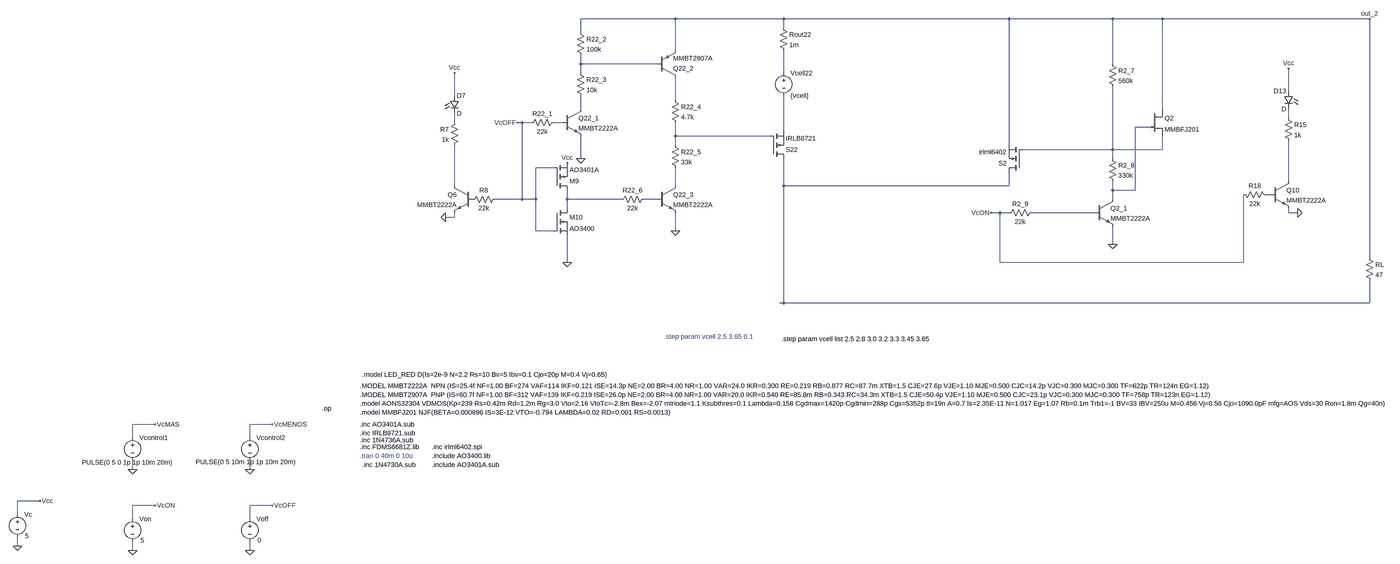
[diagram p0: schematic version_1x1.asc, whole sheet]
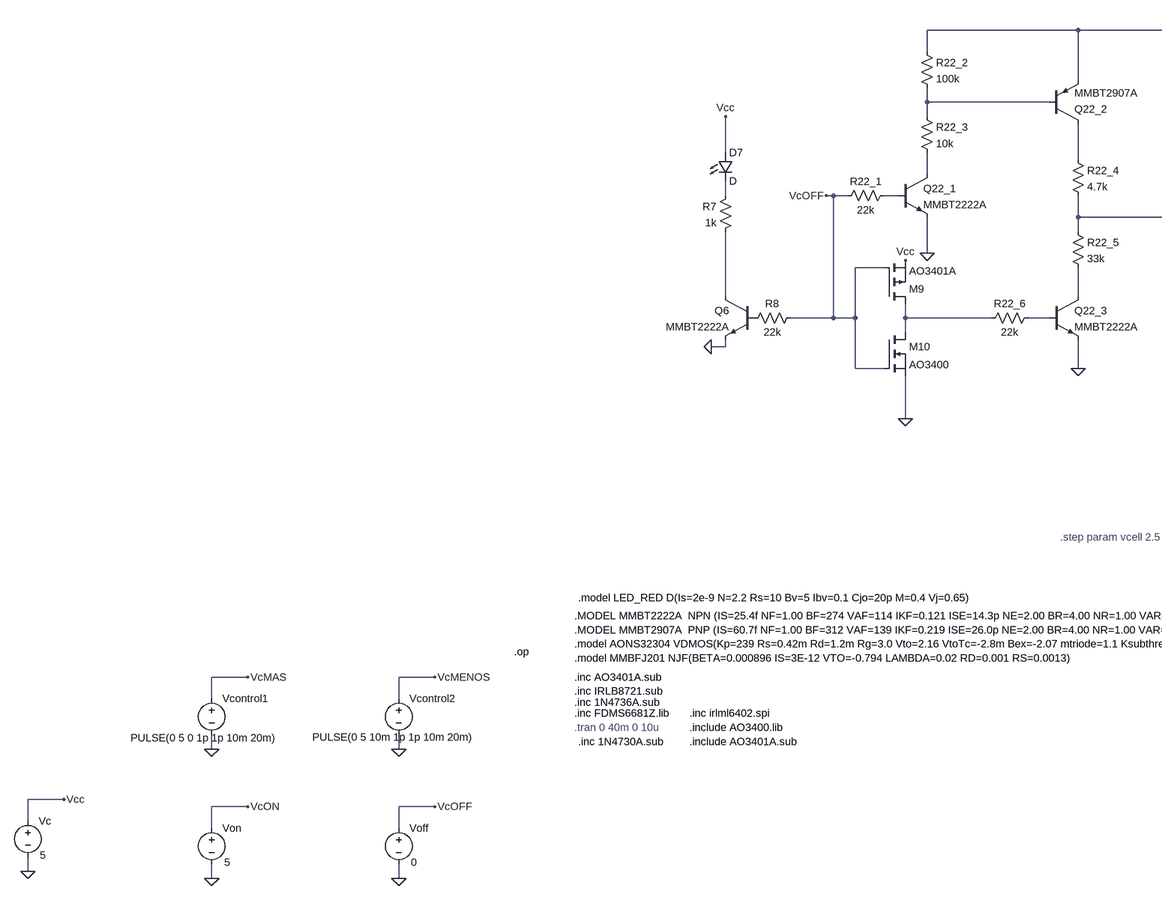
[diagram p1: schematic version_1x1.asc, part, row 1 of 1, column 1 of 2]
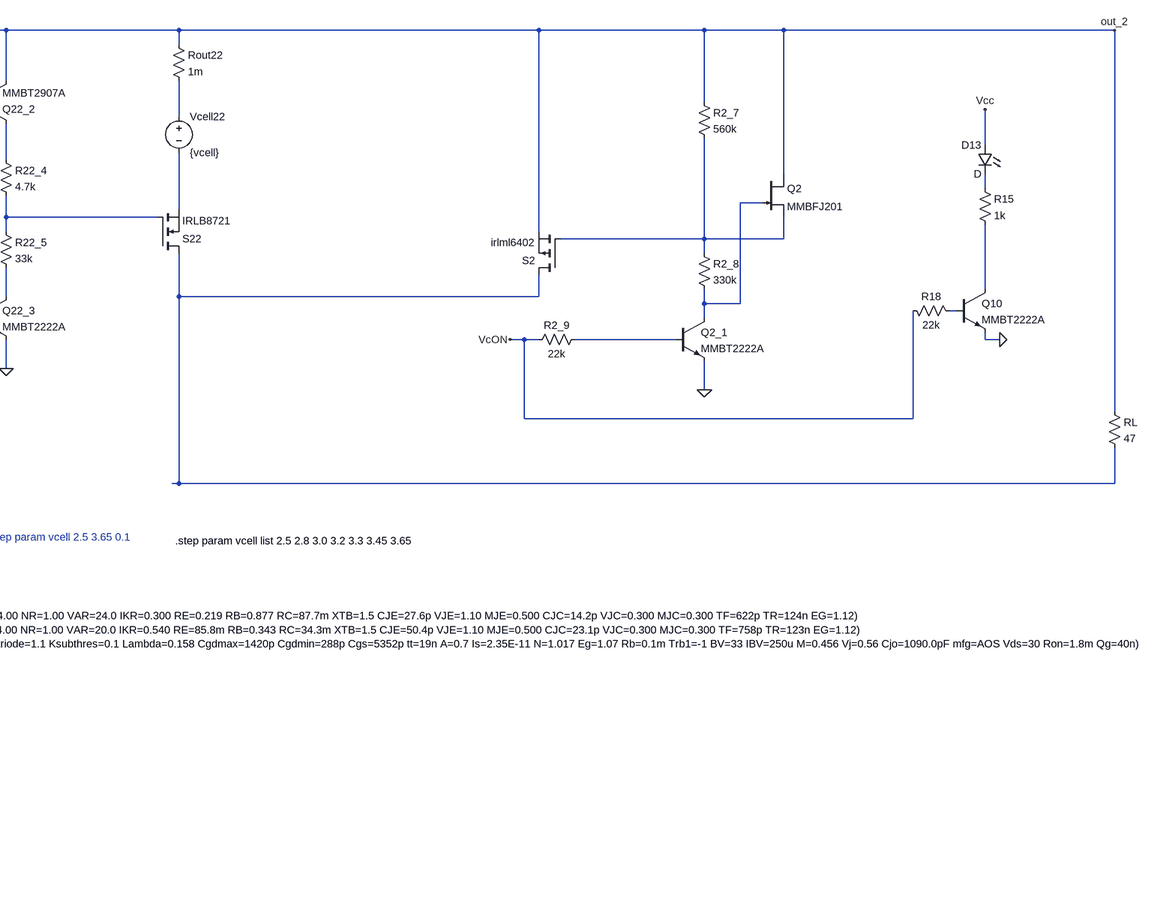
[diagram p2: schematic version_1x1.asc, part, row 1 of 1, column 2 of 2]
version_1x1.asc, the LTspice schematic file:
Version 4.1
SHEET 1 7672 2128
WIRE 896 -688 560 -688
WIRE 1280 -688 896 -688
WIRE 2080 -688 1280 -688
WIRE 2448 -688 2080 -688
WIRE 2624 -688 2448 -688
WIRE 3360 -688 2624 -688
WIRE 1280 -656 1280 -688
WIRE 560 -640 560 -688
WIRE 896 -576 896 -688
WIRE 560 -528 560 -560
WIRE 832 -528 560 -528
WIRE 2448 -528 2448 -688
WIRE 560 -496 560 -528
WIRE 1280 -496 1280 -576
WIRE 3072 -432 3072 -512
WIRE 112 -416 112 -496
WIRE 896 -400 896 -480
WIRE 560 -368 560 -416
WIRE 2624 -368 2624 -688
WIRE 3072 -336 3072 -368
WIRE 112 -320 112 -352
WIRE 352 -320 336 -320
WIRE 384 -320 352 -320
WIRE 496 -320 464 -320
WIRE 2576 -304 2528 -304
WIRE 1280 -288 1280 -416
WIRE 896 -272 896 -320
WIRE 1232 -272 896 -272
WIRE 896 -240 896 -272
WIRE 2080 -240 2080 -688
WIRE 2448 -224 2448 -448
WIRE 2448 -224 2128 -224
WIRE 2624 -224 2624 -272
WIRE 2624 -224 2448 -224
WIRE 560 -192 560 -272
WIRE 2448 -192 2448 -224
WIRE 464 -160 400 -160
WIRE 3072 -112 3072 -256
WIRE 112 -96 112 -240
WIRE 896 -96 896 -160
WIRE 1280 -96 1280 -192
WIRE 2080 -96 2080 -144
WIRE 2080 -96 1280 -96
WIRE 2448 -80 2448 -112
WIRE 2528 -80 2528 -304
WIRE 2528 -80 2448 -80
WIRE 3008 -64 2992 -64
WIRE 352 -48 352 -320
WIRE 352 -48 256 -48
WIRE 400 -48 400 -160
WIRE 400 -48 352 -48
WIRE 512 -48 512 -80
WIRE 704 -48 512 -48
WIRE 832 -48 784 -48
WIRE 2448 -48 2448 -80
WIRE 512 -16 512 -48
WIRE 2048 0 2016 0
WIRE 2080 0 2048 0
WIRE 2384 0 2160 0
WIRE 3072 0 3072 -16
WIRE 3104 0 3072 0
WIRE 112 16 112 0
WIRE 112 16 80 16
WIRE 400 64 400 -48
WIRE 464 64 400 64
WIRE 896 64 896 0
WIRE 2448 112 2448 48
WIRE 3360 160 3360 -688
WIRE 512 176 512 80
WIRE 2048 176 2048 0
WIRE 2912 176 2912 -64
WIRE 2912 176 2048 176
WIRE 1280 320 1280 -96
WIRE 1280 320 1264 320
WIRE 3360 320 3360 240
WIRE 3360 320 1280 320
WIRE -1072 1024 -1152 1024
WIRE -656 1024 -736 1024
WIRE -1152 1072 -1152 1024
WIRE -736 1072 -736 1024
WIRE -1152 1184 -1152 1152
WIRE -736 1184 -736 1152
WIRE -1504 1296 -1584 1296
WIRE -1072 1312 -1152 1312
WIRE -656 1312 -736 1312
WIRE -1584 1344 -1584 1296
WIRE -1152 1360 -1152 1312
WIRE -736 1360 -736 1312
WIRE -1584 1456 -1584 1424
WIRE -1152 1472 -1152 1440
WIRE -736 1472 -736 1440
FLAG 560 -192 0
FLAG 896 64 0
FLAG -1152 1184 0
FLAG -736 1184 0
FLAG -1072 1024 VcMAS
FLAG -656 1024 VcMENOS
FLAG -736 1472 0
FLAG -656 1312 VcOFF
FLAG -1152 1472 0
FLAG -1072 1312 VcON
FLAG 336 -320 VcOFF
FLAG 2448 112 0
FLAG 2016 0 VcON
FLAG 3360 -688 out_2
FLAG 80 16 0
FLAG 3104 0 0
FLAG 112 -496 Vcc
FLAG 3072 -512 Vcc
FLAG -1584 1456 0
FLAG -1504 1296 Vcc
FLAG 512 176 0
FLAG 512 -176 Vcc
SYMBOL npn 832 -96 R0
SYMATTR InstName Q22_3
SYMATTR Value MMBT2222A
SYMBOL res 880 -256 R0
SYMATTR InstName R22_5
SYMATTR Value 33k
SYMBOL res 880 -416 R0
SYMATTR InstName R22_4
SYMATTR Value 4.7k
SYMBOL npn 496 -368 R0
SYMATTR InstName Q22_1
SYMATTR Value MMBT2222A
SYMBOL res 544 -512 R0
SYMATTR InstName R22_3
SYMATTR Value 10k
SYMBOL res 544 -656 R0
SYMATTR InstName R22_2
SYMATTR Value 100k
SYMBOL res 800 -64 R90
WINDOW 0 0 56 VBottom 2
WINDOW 3 32 56 VTop 2
SYMATTR InstName R22_6
SYMATTR Value 22k
SYMBOL voltage 1280 -512 R0
WINDOW 123 0 0 Left 0
WINDOW 39 0 0 Left 0
SYMATTR InstName Vcell22
SYMATTR Value {vcell}
SYMBOL pnp 832 -480 M180
SYMATTR InstName Q22_2
SYMATTR Value MMBT2907A
SYMBOL nmos 1232 -192 M180
SYMATTR InstName S22
SYMATTR Value IRLB8721
SYMATTR Prefix X
SYMBOL voltage -1152 1056 R0
WINDOW 3 -180 103 Left 2
WINDOW 123 0 0 Left 0
WINDOW 39 0 0 Left 0
SYMATTR Value PULSE(0 5 0 1p 1p 10m 20m)
SYMATTR InstName Vcontrol1
SYMBOL voltage -736 1056 R0
WINDOW 3 -192 102 Left 2
WINDOW 123 0 0 Left 0
WINDOW 39 0 0 Left 0
SYMATTR Value PULSE(0 5 10m 1p 1p 10m 20m)
SYMATTR InstName Vcontrol2
SYMBOL voltage -736 1344 R0
WINDOW 3 27 92 Left 2
WINDOW 123 0 0 Left 0
WINDOW 39 0 0 Left 0
SYMATTR Value 0
SYMATTR InstName Voff
SYMBOL voltage -1152 1344 R0
WINDOW 3 28 92 Left 2
WINDOW 123 0 0 Left 0
WINDOW 39 0 0 Left 0
SYMATTR Value 5
SYMATTR InstName Von
SYMBOL res 480 -336 R90
WINDOW 0 0 56 VBottom 2
WINDOW 3 32 56 VTop 2
SYMATTR InstName R22_1
SYMATTR Value 22k
SYMBOL res 1264 -672 R0
SYMATTR InstName Rout22
SYMATTR Value 1m
SYMBOL npn 2384 -48 R0
SYMATTR InstName Q2_1
SYMATTR Value MMBT2222A
SYMBOL res 2176 -16 R90
WINDOW 0 0 56 VBottom 2
WINDOW 3 32 56 VTop 2
SYMATTR InstName R2_9
SYMATTR Value 22k
SYMBOL res 2432 -544 R0
SYMATTR InstName R2_7
SYMATTR Value 560k
SYMBOL pmos 2128 -144 R180
SYMATTR InstName S2
SYMATTR Value irlml6402
SYMATTR Prefix X
SYMBOL npn 176 -96 M0
SYMATTR InstName Q6
SYMATTR Value MMBT2222A
SYMBOL res 128 -336 M0
SYMATTR InstName R7
SYMATTR Value 1k
SYMBOL res 272 -64 R90
WINDOW 0 0 56 VBottom 2
WINDOW 3 32 56 VTop 2
SYMATTR InstName R8
SYMATTR Value 22k
SYMBOL LED 96 -416 R0
SYMATTR InstName D7
SYMBOL npn 3008 -112 R0
SYMATTR InstName Q10
SYMATTR Value MMBT2222A
SYMBOL res 3056 -352 R0
SYMATTR InstName R15
SYMATTR Value 1k
SYMBOL res 2896 -80 M90
WINDOW 0 0 56 VBottom 2
WINDOW 3 32 56 VTop 2
SYMATTR InstName R18
SYMATTR Value 22k
SYMBOL LED 3088 -432 M0
SYMATTR InstName D13
SYMBOL res 2432 -208 R0
SYMATTR InstName R2_8
SYMATTR Value 330k
SYMBOL res 3344 144 R0
SYMATTR InstName RL
SYMATTR Value 47
SYMBOL voltage -1584 1328 R0
WINDOW 3 27 92 Left 2
WINDOW 123 0 0 Left 0
WINDOW 39 0 0 Left 0
SYMATTR Value 5
SYMATTR InstName Vc
SYMBOL pmos 464 -80 M180
SYMATTR InstName M9
SYMATTR Value AO3401A
SYMATTR Prefix X
SYMBOL nmos 464 -16 R0
SYMATTR InstName M10
SYMATTR Value AO3400
SYMATTR Prefix X
SYMBOL njf 2576 -368 R0
SYMATTR InstName Q2
SYMATTR Value MMBFJ201
TEXT -224 1136 Left 2 ;.tran 0 40m 0 10u
TEXT -224 888 Left 2 !.MODEL MMBT2222A  NPN (IS=25.4f NF=1.00 BF=274 VAF=114 IKF=0.121 ISE=14.3p NE=2.00 BR=4.00 NR=1.00 VAR=24.0 IKR=0.300 RE=0.219 RB=0.877 RC=87.7m XTB=1.5 CJE=27.6p VJE=1.10 MJE=0.500 CJC=14.2p VJC=0.300 MJC=0.300 TF=622p TR=124n EG=1.12)\n.MODEL MMBT2907A  PNP (IS=60.7f NF=1.00 BF=312 VAF=139 IKF=0.219 ISE=26.0p NE=2.00 BR=4.00 NR=1.00 VAR=20.0 IKR=0.540 RE=85.8m RB=0.343 RC=34.3m XTB=1.5 CJE=50.4p VJE=1.10 MJE=0.500 CJC=23.1p VJC=0.300 MJC=0.300 TF=758p TR=123n EG=1.12)\n.model AONS32304 VDMOS(Kp=239 Rs=0.42m Rd=1.2m Rg=3.0 Vto=2.16 VtoTc=-2.8m Bex=-2.07 mtriode=1.1 Ksubthres=0.1 Lambda=0.158 Cgdmax=1420p Cgdmin=288p Cgs=5352p tt=19n A=0.7 Is=2.35E-11 N=1.017 Eg=1.07 Rb=0.1m Trb1=-1 BV=33 IBV=250u M=0.456 Vj=0.56 Cjo=1090.0pF mfg=AOS Vds=30 Ron=1.8m Qg=40n)\n.model MMBFJ201 NJF(BETA=0.000896 IS=3E-12 VTO=-0.794 LAMBDA=0.02 RD=0.001 RS=0.0013)
TEXT -224 1024 Left 2 !.inc AO3401A.sub\n.inc IRLB8721.sub
TEXT -224 1080 Left 2 !.inc 1N4736A.sub
TEXT -224 1104 Left 2 !.inc FDMS6681Z.lib
TEXT -216 1168 Left 2 !.inc 1N4730A.sub
TEXT -216 848 Left 2 !.model LED_RED D(Is=2e-9 N=2.2 Rs=10 Bv=5 Ibv=0.1 Cjo=20p M=0.4 Vj=0.65)
TEXT 32 1104 Left 2 !.inc irlml6402.spi
TEXT 32 1136 Left 2 !.include AO3400.lib
TEXT 32 1168 Left 2 !.include AO3401A.sub
TEXT -480 968 Left 2 !.op
TEXT 856 648 Left 2 ;.step param vcell 2.5 3.65 0.1
TEXT 1272 656 Left 2 !.step param vcell list 2.5 2.8 3.0 3.2 3.3 3.45 3.65

The netlist it stands for:
* version_1x1.asc
Q22_3 N014 N018 0 0 MMBT2222A
R22_5 N010 N014 33k
R22_4 N003 N010 4.7k
Q22_1 N004 N007 0 0 MMBT2222A
R22_3 N001 N004 10k
R22_2 out_2 N001 100k
R22_6 N018 N017 22k
Vcell22 N002 N009 {vcell}
Q22_2 N003 N001 out_2 0 MMBT2907A
X§S22 N015 N010 N009 IRLB8721  ; pins D G S
Vcontrol1 VcMAS 0 PULSE(0 5 0 1p 1p 10m 20m)
Vcontrol2 VcMENOS 0 PULSE(0 5 10m 1p 1p 10m 20m)
Voff VcOFF 0 0
Von VcON 0 5
R22_1 N007 VcOFF 22k
Rout22 out_2 N002 1m
Q2_1 N008 N019 0 0 MMBT2222A
R2_9 N019 VcON 22k
R2_7 out_2 N011 560k
X§S2 N015 N011 out_2 irlml6402  ; pins D G S
Q6 N013 P001 0 0 MMBT2222A
R7 N006 N013 1k
R8 VcOFF P001 22k
D7 Vcc N006 D
Q10 N012 N016 0 0 MMBT2222A
R15 N005 N012 1k
R18 VcON N016 22k
D13 Vcc N005 D
R2_8 N011 N008 330k
RL out_2 N015 47
Vc Vcc 0 5
X§M9 N017 VcOFF Vcc AO3401A  ; pins D G S
X§M10 N017 VcOFF 0 AO3400  ; pins D G S
J§Q2 out_2 N008 N011 MMBFJ201
.model D D
.lib standard.dio
.model NPN NPN
.model PNP PNP
.lib standard.bjt
.model NJF NJF
.model PJF PJF
.lib standard.jft
* .tran 0 40m 0 10u
.MODEL MMBT2222A  NPN (IS=25.4f NF=1.00 BF=274 VAF=114 IKF=0.121 ISE=14.3p NE=2.00 BR=4.00 NR=1.00 VAR=24.0 IKR=0.300 RE=0.219 RB=0.877 RC=87.7m XTB=1.5 CJE=27.6p VJE=1.10 MJE=0.500 CJC=14.2p VJC=0.300 MJC=0.300 TF=622p TR=124n EG=1.12)
.MODEL MMBT2907A  PNP (IS=60.7f NF=1.00 BF=312 VAF=139 IKF=0.219 ISE=26.0p NE=2.00 BR=4.00 NR=1.00 VAR=20.0 IKR=0.540 RE=85.8m RB=0.343 RC=34.3m XTB=1.5 CJE=50.4p VJE=1.10 MJE=0.500 CJC=23.1p VJC=0.300 MJC=0.300 TF=758p TR=123n EG=1.12)
.model AONS32304 VDMOS(Kp=239 Rs=0.42m Rd=1.2m Rg=3.0 Vto=2.16 VtoTc=-2.8m Bex=-2.07 mtriode=1.1 Ksubthres=0.1 Lambda=0.158 Cgdmax=1420p Cgdmin=288p Cgs=5352p tt=19n A=0.7 Is=2.35E-11 N=1.017 Eg=1.07 Rb=0.1m Trb1=-1 BV=33 IBV=250u M=0.456 Vj=0.56 Cjo=1090.0pF mfg=AOS Vds=30 Ron=1.8m Qg=40n)
.model MMBFJ201 NJF(BETA=0.000896 IS=3E-12 VTO=-0.794 LAMBDA=0.02 RD=0.001 RS=0.0013)
.inc AO3401A.sub
.inc IRLB8721.sub
.inc 1N4736A.sub
.inc FDMS6681Z.lib
.inc 1N4730A.sub
.model LED_RED D(Is=2e-9 N=2.2 Rs=10 Bv=5 Ibv=0.1 Cjo=20p M=0.4 Vj=0.65)
.inc irlml6402.spi
.include AO3400.lib
.include AO3401A.sub
.op
* .step param vcell 2.5 3.65 0.1
.step param vcell list 2.5 2.8 3.0 3.2 3.3 3.45 3.65
.backanno
.end